# EAGLE design MUX_circuits (EAGLE 7.7.0)
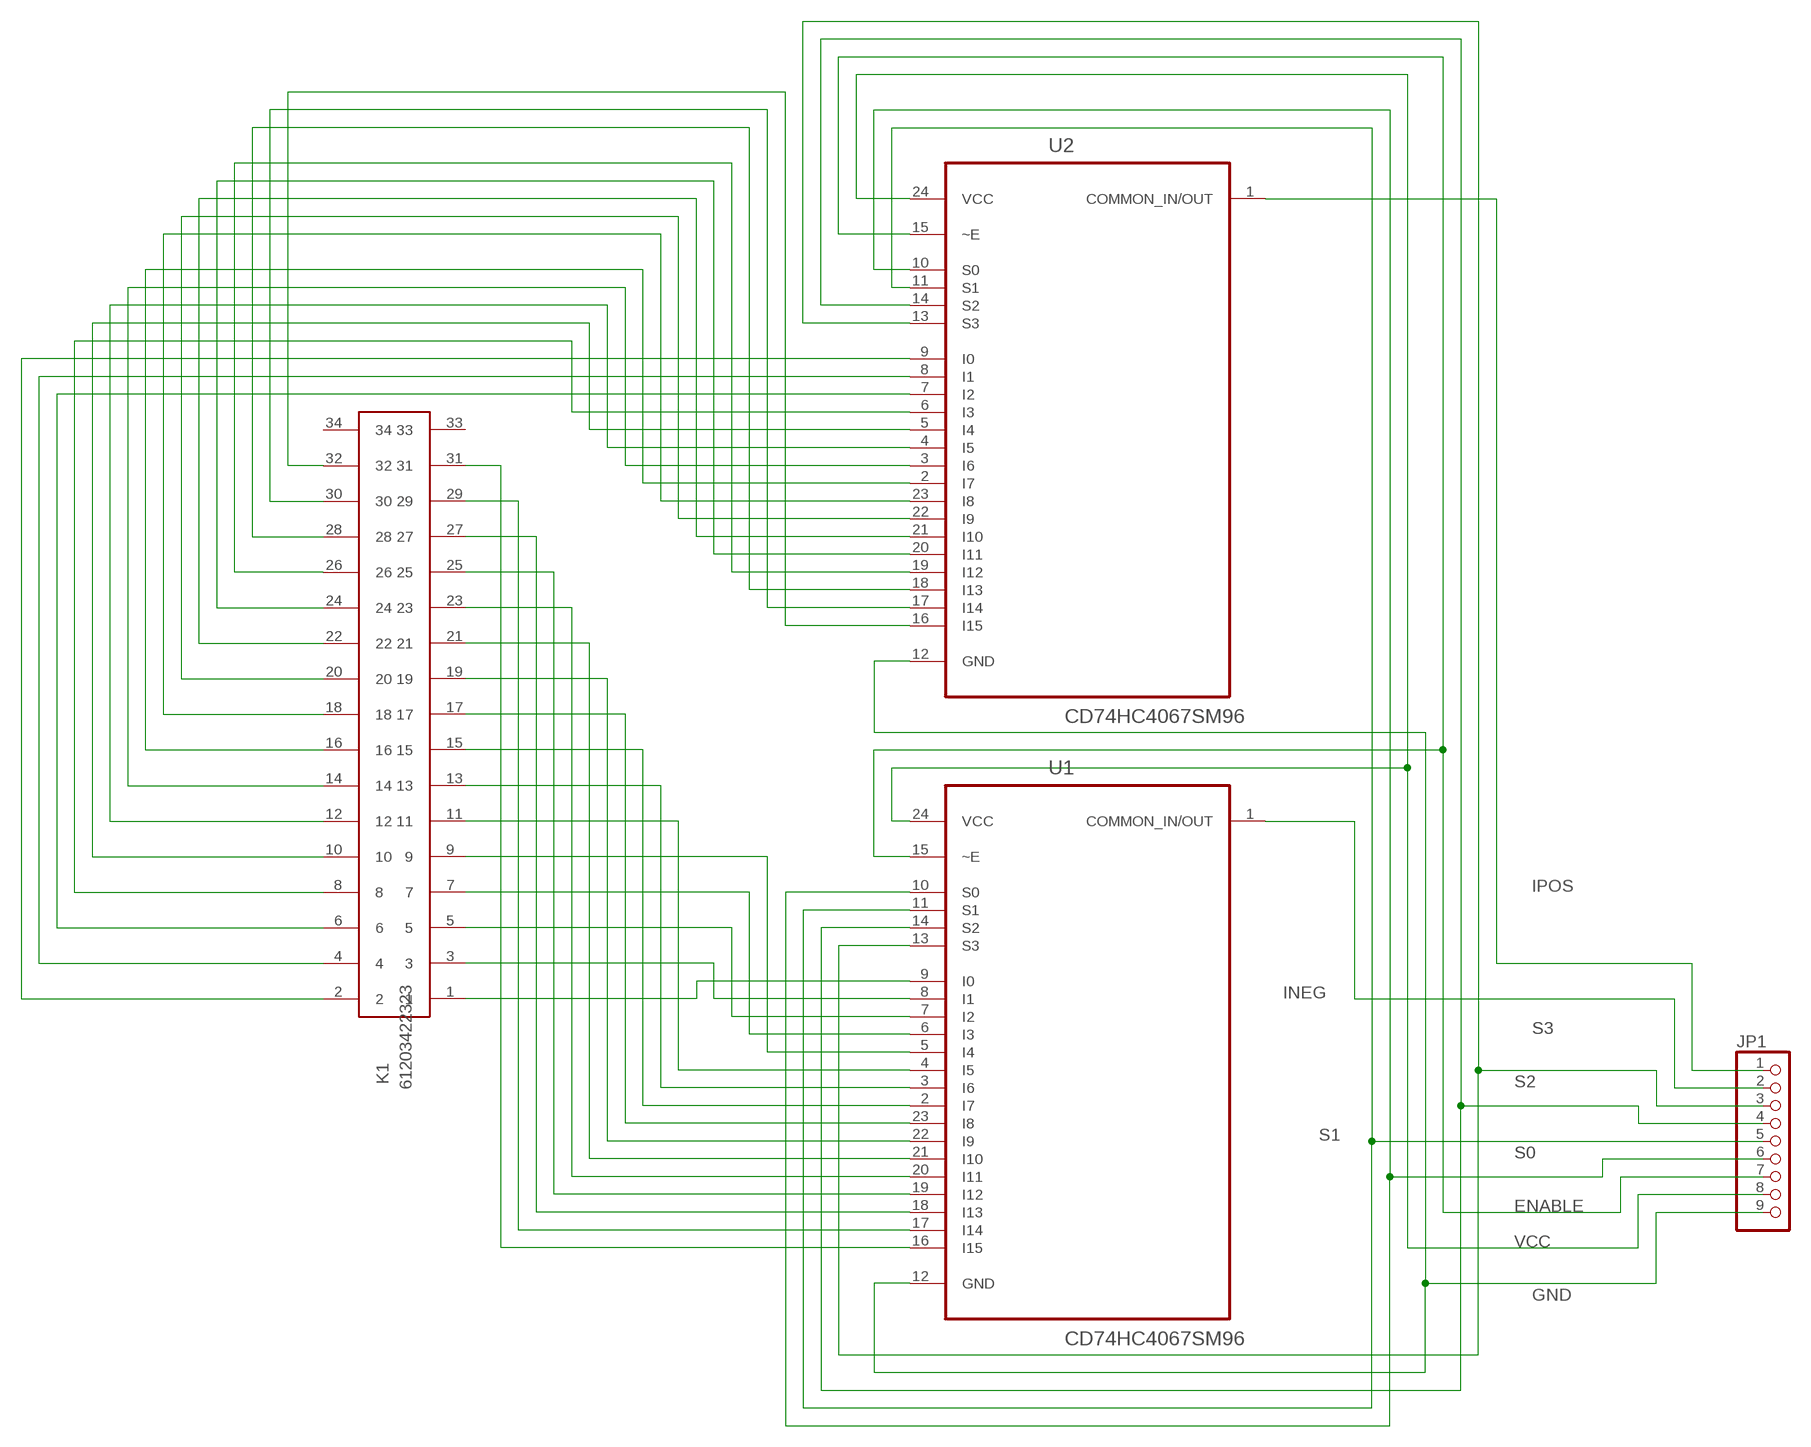
[diagram p0: schematic, sheet 1]

## Parts
JP1  PINHD-1X9  [1X09]
K1  61203422323  [61203422323]
U1  CD74HC4067SM96  [SOP65P780X200-24N]
U2  CD74HC4067SM96  [SOP65P780X200-24N]

## Nets
ENABLE: JP1.7 U1.15(~E) U2.15(~E)
GND: JP1.9 U1.12(GND) U2.12(GND)
INEG: JP1.2 U1.1(COMMON_IN/OUT)
IPOS: JP1.1 U2.1(COMMON_IN/OUT)
N$1: K1.1 U1.9(I0)
N$2: K1.2 U2.9(I0)
N$3: K1.3 U1.8(I1)
N$4: K1.5 U1.7(I2)
N$5: K1.7 U1.6(I3)
N$6: K1.9 U1.5(I4)
N$7: K1.11 U1.4(I5)
N$8: K1.13 U1.3(I6)
N$9: K1.15 U1.2(I7)
N$10: K1.17 U1.23(I8)
N$11: K1.19 U1.22(I9)
N$12: K1.21 U1.21(I10)
N$13: K1.23 U1.20(I11)
N$14: K1.25 U1.19(I12)
N$15: K1.27 U1.18(I13)
N$16: K1.29 U1.17(I14)
N$17: K1.31 U1.16(I15)
N$18: K1.4 U2.8(I1)
N$19: K1.6 U2.7(I2)
N$20: K1.8 U2.6(I3)
N$21: K1.10 U2.5(I4)
N$22: K1.12 U2.4(I5)
N$23: K1.14 U2.3(I6)
N$24: K1.16 U2.2(I7)
N$25: K1.18 U2.23(I8)
N$26: K1.20 U2.22(I9)
N$27: K1.22 U2.21(I10)
N$28: K1.24 U2.20(I11)
N$29: K1.26 U2.19(I12)
N$30: K1.28 U2.18(I13)
N$31: K1.30 U2.17(I14)
N$32: K1.32 U2.16(I15)
S0: JP1.6 U1.10(S0) U2.10(S0)
S1: JP1.5 U1.11(S1) U2.11(S1)
S2: JP1.4 U1.14(S2) U2.14(S2)
S3: JP1.3 U1.13(S3) U2.13(S3)
VCC: JP1.8 U1.24(VCC) U2.24(VCC)
Unconnected: K1.33 K1.34

## Library data of the parts
JP1 = pinhead:PINHD-1X9: PIN HEADER
K1 = Wire_to_Board_Connectors_rev15d:61203422323: WR-BHD 2.54mm Board to Cable Transition Connector, 34 Pins=>Code : Con_WTB_IDC_61203422323 <http://katalog.we-online.de/media/thumbs2/eican/thb_Con_WTB_IDC_6120xx22323_pf2.jpg> Details see: http://katalog.we-online.de/en/em/612_0xx_223_23 Created 2014-06-05, Karrer Zheng 2014 (C) Würth Elektronik
U1 U2 = Texas Instruments_By_element14_Batch_1:CD74HC4067SM96: 16-Channel Analog Multiplexer/Demultiplexer; MPN: CD74HC4067SM96; OC_FARNELL: 1601157; OC_NEWARK: 13N4201; PACKAGE: SOP-24; SUPPLIER: TEXAS INSTRUMENTS

## Board
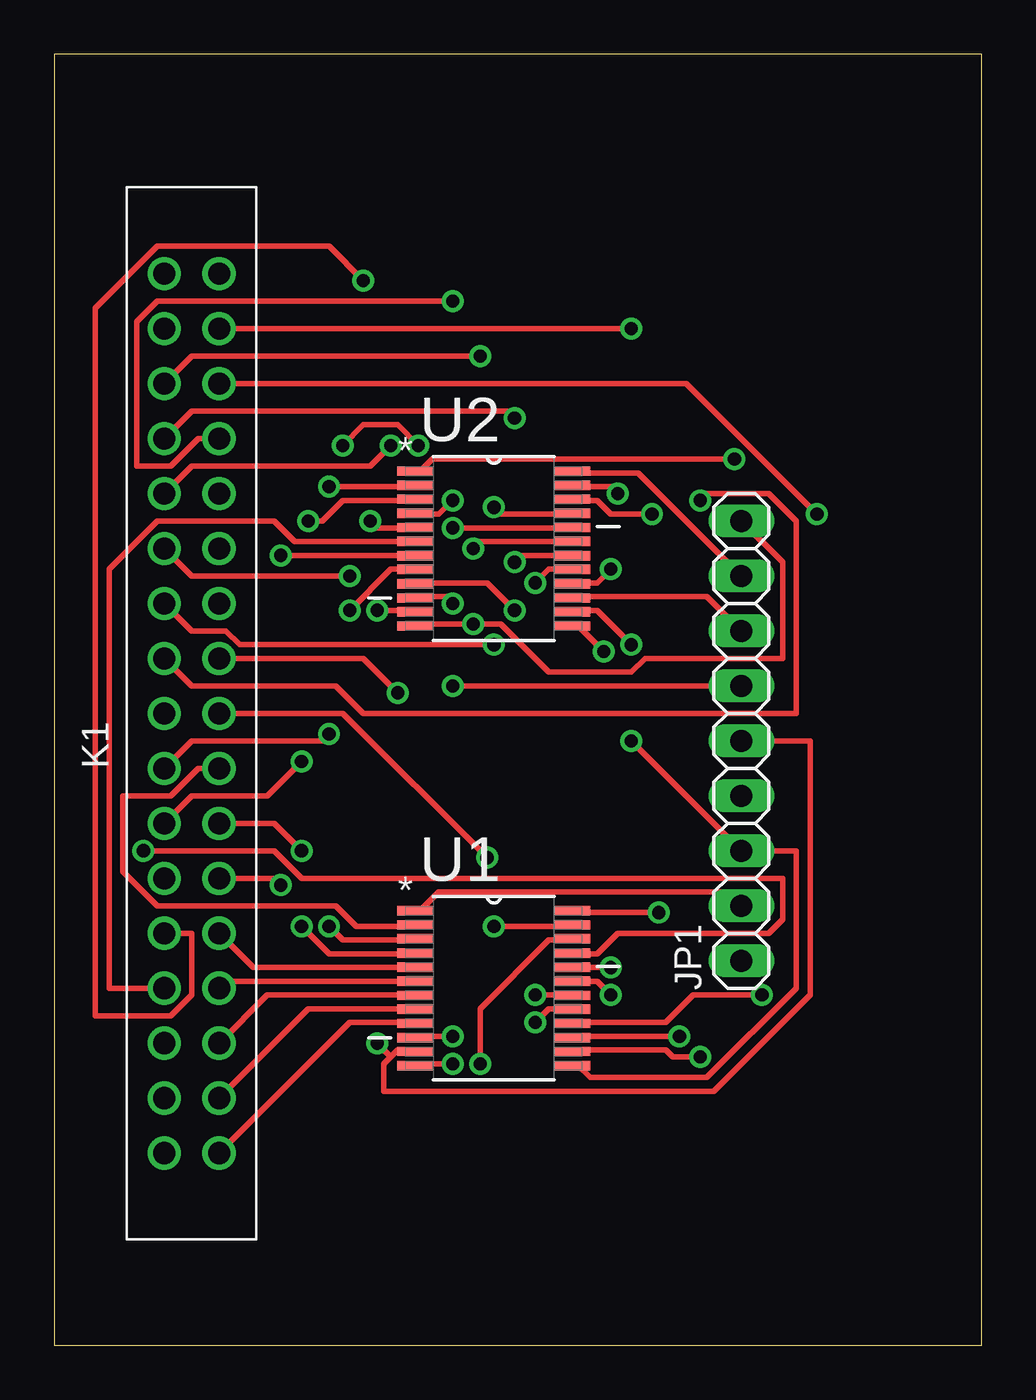
[diagram p1: board, top side]
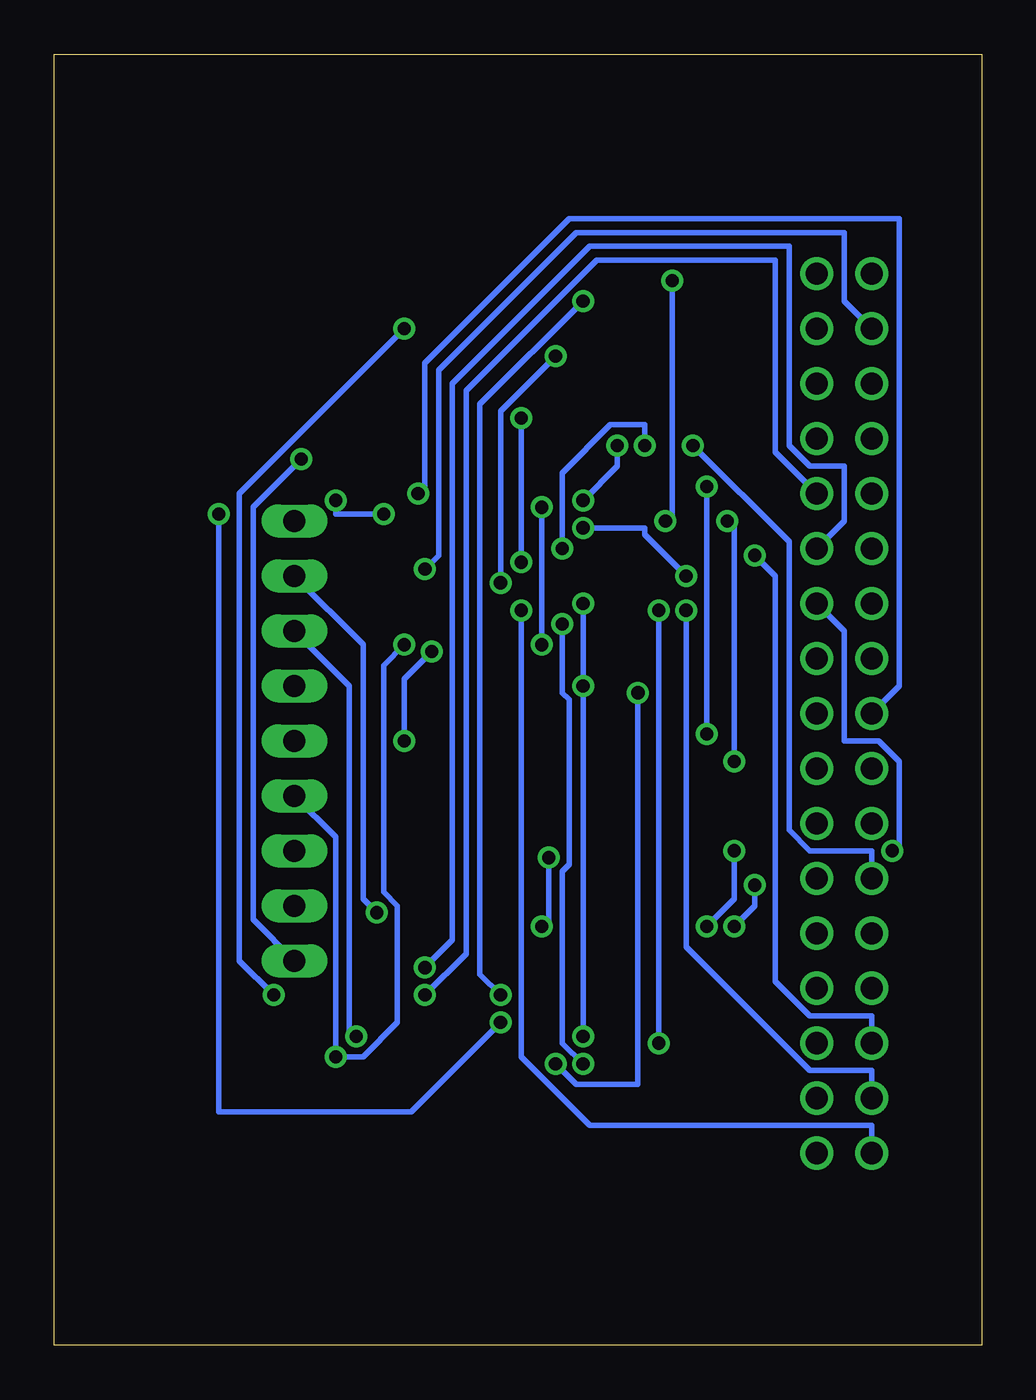
[diagram p2: board, bottom side, seen from below]

Size 42.85 x 59.68 mm. Coordinates in mm from the lower left corner, seen from the top.
Outline: 0,0 42.85,0 42.85,59.68 0,59.68 0,0
Copper layers (1*16): Top 0.035mm / dielectric 1.5mm / Bottom 0.035mm
Design rules "default": minimum track width 10mil, minimum drill 24mil, track to track 8mil, track to pad 8mil, pad to pad 8mil, via to via 8mil, smd to smd 8mil, copper to edge 40mil, drill to drill 8mil, minimum pad ring 10mil, minimum via ring 8mil, stop-mask expansion 4mil, vias tented up to drill 0mil, thermal gap 10mil

### Footprints (pad centres in the part's own frame; a part is rotated, then mirrored left to right if it is on the bottom)
1X09 = drill 1.016 long: 1 -10.16,0; 2 -7.62,0; 3 -5.08,0; 4 -2.54,0; 5 0,0; 6 2.54,0; 7 5.08,0; 8 7.62,0; 9 10.16,0
61203422323 = drill 1.02: 1 -2.54,-1.27; 2 -2.54,1.27; 3 0,-1.27; 4 0,1.27; 5 2.54,-1.27; 6 2.54,1.27; 7 5.08,-1.27; 8 5.08,1.27; 9 7.62,-1.27; 10 7.62,1.27; 11 10.16,-1.27; 12 10.16,1.27; 13 12.7,-1.27; 14 12.7,1.27; 15 15.24,-1.27; 16 15.24,1.27; 17 17.78,-1.27; 18 17.78,1.27; 19 20.32,-1.27; 20 20.32,1.27; 21 22.86,-1.27; 22 22.86,1.27; 23 25.4,-1.27; 24 25.4,1.27; 25 27.94,-1.27; 26 27.94,1.27; 27 30.48,-1.27; 28 30.48,1.27; 29 33.02,-1.27; 30 33.02,1.27; 31 35.56,-1.27; 32 35.56,1.27; 33 38.1,-1.27; 34 38.1,1.27
SOP65P780X200-24N = smd 1.651 x 0.432: 1 -3.632,3.581; 2 -3.632,2.921; 3 -3.632,2.286; 4 -3.632,1.626; 5 -3.632,0.965; 6 -3.632,0.33; 7 -3.632,-0.33; 8 -3.632,-0.965; 9 -3.632,-1.626; 10 -3.632,-2.286; 11 -3.632,-2.921; 12 -3.632,-3.581; 13 3.632,-3.581; 14 3.632,-2.921; 15 3.632,-2.286; 16 3.632,-1.626; 17 3.632,-0.965; 18 3.632,-0.33; 19 3.632,0.33; 20 3.632,0.965; 21 3.632,1.626; 22 3.632,2.286; 23 3.632,2.921; 24 3.632,3.581

### Placement (x,y rotation side)
JP1  31.75,27.94 90 top
K1  6.35,11.43 90 top
U1  20.32,16.51 0 top
U2  20.32,36.83 0 top

### Tracks (layer width: path | path; a pad name or v marks a point on that pad's centre or on a via)
ENABLE  (via drill 0.61)
  Top 0.254: v28.89,14.29 24.13,14.29 U1.15 | JP1.7 30.16,34.61 24.13,34.61 U2.15
  Bottom 0.254: v28.89,14.29 29.21,14.61 29.21,30.48 JP1.7
GND  (via drill 0.61)
  Top 0.254: v18.41,13.02 16.83,13.02 U1.12 | U2.12 16.83,33.34 v19.37,33.34 20.64,33.34 22.86,31.11 26.67,31.11 27.3,31.75 33.66,31.75 33.66,36.2 JP1.9
  Bottom 0.254: v18.41,13.02 19.37,13.97 19.37,21.91 19.05,22.23 19.05,29.84 19.37,30.16 v19.37,33.34
INEG
  Top 0.254: JP1.2 31.11,20.95 17.78,20.95 16.83,20 U1.1
IPOS  (via drill 0.61)
  Top 0.254: v31.43,40.96 17.46,40.96 16.83,40.32 U2.1
  Bottom 0.254: v31.43,40.96 33.66,38.73 33.66,19.68 JP1.1
N$1
  Top 0.254: K1.1 13.65,14.92 16.51,14.92 U1.9
N$2  (via drill 0.61)
  Top 0.254: v21.27,33.97 20,35.24 16.83,35.24 U2.9
  Bottom 0.254: v21.27,33.97 21.27,13.34 18.1,10.16 5.08,10.16 K1.2
N$3
  Top 0.254: K1.3 11.75,15.56 16.51,15.56 U1.8
N$4
  Top 0.254: K1.5 9.84,16.19 16.51,16.19 U1.7
N$5
  Top 0.254: K1.7 7.94,16.83 16.51,16.83 U1.6
N$6
  Top 0.254: K1.9 9.21,17.46 16.51,17.46 U1.5
N$7  (via drill 0.61)
  Top 0.254: v11.43,19.37 12.7,18.1 16.51,18.1 U1.4 | v10.48,21.27 10.16,21.59 K1.11
  Bottom 0.254: v11.43,19.37 10.48,20.32 v10.48,21.27
N$8  (via drill 0.61)
  Top 0.254: v12.7,19.37 13.34,18.73 16.51,18.73 U1.3 | v11.43,22.86 10.16,24.13 K1.13
  Bottom 0.254: v12.7,19.37 11.43,20.64 v11.43,22.86
N$9
  Top 0.254: K1.15 6.67,26.67 5.4,25.4 3.17,25.4 3.17,21.91 4.76,20.32 13.02,20.32 13.97,19.37 16.51,19.37 U1.2
N$10  (via drill 0.61)
  Top 0.254: v20.32,19.37 23.81,19.37 U1.23 | v20,22.54 13.34,29.21 K1.17
  Bottom 0.254: v20.32,19.37 20,19.68 v20,22.54
N$11  (via drill 0.61)
  Top 0.254: v19.68,13.02 19.68,15.56 22.86,18.73 23.81,18.73 U1.22 | v15.88,30.16 14.29,31.75 K1.19
  Bottom 0.254: v19.68,13.02 18.73,12.06 15.88,12.06 v15.88,30.16
N$12  (via drill 0.61)
  Top 0.254: v4.13,22.86 10.16,22.86 11.43,21.59 33.66,21.59 33.66,19.68 33.02,19.05 26.04,19.05 25.08,18.1 24.13,18.1 U1.21
  Bottom 0.254: v4.13,22.86 3.81,23.18 3.81,26.99 4.76,27.94 6.35,27.94 6.35,33.02 K1.21
N$13  (via drill 0.61)
  Top 0.254: v25.72,17.46 24.13,17.46 U1.20
  Bottom 0.254: v25.72,17.46 24.45,18.73 24.45,44.45 18.1,50.8 8.89,50.8 8.89,41.59 7.94,40.64 6.35,40.64 6.35,38.1 K1.23
N$14  (via drill 0.61)
  Top 0.254: v25.72,16.19 25.08,16.83 24.13,16.83 U1.19
  Bottom 0.254: v25.72,16.19 23.81,18.1 23.81,44.13 17.78,50.16 9.53,50.16 9.53,41.27 K1.25
N$15  (via drill 0.61)
  Top 0.254: v22.23,16.19 23.81,16.19 U1.18 | v18.41,48.26 4.76,48.26 3.81,47.31 3.81,40.64 5.4,40.64 6.67,41.91 K1.27
  Bottom 0.254: v22.23,16.19 23.18,17.14 23.18,43.5 v18.41,48.26
N$16  (via drill 0.61)
  Top 0.254: v22.23,14.92 22.86,15.56 23.81,15.56 U1.17 | v35.24,38.42 29.21,44.45 K1.29
  Bottom 0.254: v22.23,14.92 26.35,10.79 35.24,10.79 v35.24,38.42
N$17  (via drill 0.61)
  Top 0.254: v32.7,16.19 29.53,16.19 28.26,14.92 24.13,14.92 U1.16 | K1.31 v26.67,46.99
  Bottom 0.254: v32.7,16.19 34.29,17.78 34.29,39.37 v26.67,46.99
N$18  (via drill 0.61)
  Top 0.254: v13.65,33.97 15.56,35.88 16.51,35.88 U2.8
  Bottom 0.254: v13.65,33.97 13.65,18.41 7.94,12.7 5.08,12.7 K1.4
N$19  (via drill 0.61)
  Top 0.254: v10.48,36.51 16.51,36.51 U2.7
  Bottom 0.254: v10.48,36.51 9.53,35.56 9.53,16.83 7.94,15.24 5.08,15.24 K1.6
N$20
  Top 0.254: K1.8 2.54,16.51 2.54,35.88 4.76,38.1 10.16,38.1 11.11,37.15 16.51,37.15 U2.6
N$21  (via drill 0.61)
  Top 0.254: v14.61,38.1 14.92,37.78 16.51,37.78 U2.5 | v14.29,49.21 12.7,50.8 4.76,50.8 1.91,47.94 1.91,15.24 5.4,15.24 6.35,16.19 6.35,19.05 K1.10
  Bottom 0.254: v14.61,38.1 14.29,38.42 v14.29,49.21
N$22  (via drill 0.61)
  Top 0.254: v18.41,39.05 17.78,38.42 16.83,38.42 U2.4 | v16.83,41.59 15.88,42.55 14.29,42.55 v13.34,41.59
  Bottom 0.254: v18.41,39.05 16.83,40.64 v16.83,41.59 | v13.34,41.59 8.89,37.15 8.89,23.81 7.94,22.86 5.08,22.86 K1.12
N$23  (via drill 0.61)
  Top 0.254: v11.75,38.1 12.38,38.1 13.34,39.05 16.51,39.05 U2.3 | v11.43,26.99 9.84,25.4 6.35,25.4 K1.14
  Bottom 0.254: v11.75,38.1 11.43,37.78 v11.43,26.99
N$24  (via drill 0.61)
  Top 0.254: v12.7,39.69 16.51,39.69 U2.2 | v12.7,28.26 12.38,27.94 6.35,27.94 K1.16
  Bottom 0.254: v12.7,28.26 v12.7,39.69
N$25  (via drill 0.61)
  Top 0.254: v26.04,39.37 25.72,39.69 24.13,39.69 U2.23
  Bottom 0.254: v26.04,39.37 25.72,39.69 25.72,45.4 19.05,52.07 3.81,52.07 3.81,30.48 K1.18
N$26  (via drill 0.61)
  Top 0.254: v27.62,38.42 25.72,38.42 25.08,39.05 24.13,39.05 U2.22 | v29.84,39.05 30.16,39.37 33.02,39.37 34.29,38.1 34.29,29.21 14.29,29.21 13.02,30.48 6.35,30.48 K1.20
  Bottom 0.254: v27.62,38.42 29.84,38.42 v29.84,39.05
N$27  (via drill 0.61)
  Top 0.254: v20.32,38.73 20.64,38.42 23.81,38.42 U2.21 | v20.32,32.38 8.57,32.38 7.94,33.02 6.35,33.02 K1.22
  Bottom 0.254: v20.32,32.38 v20.32,38.73
N$28  (via drill 0.61)
  Top 0.254: v18.41,37.78 23.81,37.78 U2.20 | v13.65,35.56 6.35,35.56 K1.24
  Bottom 0.254: v18.41,37.78 15.56,37.78 15.56,37.47 v13.65,35.56
N$29  (via drill 0.61)
  Top 0.254: v19.37,36.83 19.68,37.15 23.81,37.15 U2.19 | v15.56,41.59 14.61,40.64 6.35,40.64 K1.26
  Bottom 0.254: v19.37,36.83 19.37,40.32 17.14,42.55 15.56,42.55 v15.56,41.59
N$30  (via drill 0.61)
  Top 0.254: v21.27,36.2 21.59,36.51 23.81,36.51 U2.18 | v21.27,42.86 20.95,43.18 6.35,43.18 K1.28
  Bottom 0.254: v21.27,42.86 v21.27,36.2
N$31  (via drill 0.61)
  Top 0.254: v22.23,35.24 22.86,35.88 23.81,35.88 U2.17 | v19.68,45.72 6.35,45.72 K1.30
  Bottom 0.254: v22.23,35.24 22.23,43.18 v19.68,45.72
N$32  (via drill 0.61)
  Top 0.254: v25.72,35.88 25.08,35.24 24.13,35.24 U2.16
  Bottom 0.254: v25.72,35.88 25.08,36.51 25.08,45.09 18.73,51.44 6.35,51.44 6.35,48.26 K1.32
S0  (via drill 0.61)
  Top 0.254: v18.41,14.29 16.83,14.29 U1.10 | v18.41,34.29 18.1,34.61 16.83,34.61 U2.10 | v18.41,30.48 JP1.6
  Bottom 0.254: v18.41,34.29 v18.41,30.48 v18.41,14.29
S1  (via drill 0.61)
  Top 0.254: 15.56,13.34 15.24,13.02 15.24,11.75 30.48,11.75 34.92,16.19 34.92,27.94 JP1.5 | 15.56,13.34 15.88,13.65 16.51,13.65 U1.11 | v14.92,33.97 16.51,33.97 U2.11 | 15.56,13.34 v14.92,13.97
  Bottom 0.254: v14.92,13.97 v14.92,33.97
S2  (via drill 0.61)
  Top 0.254: v29.84,13.34 28.57,13.34 28.26,13.65 24.13,13.65 U1.14 | v26.67,32.38 25.08,33.97 24.13,33.97 U2.14
  Bottom 0.254: JP1.4 29.84,23.5 v29.84,13.34 28.57,13.34 26.99,14.92 26.99,20.32 27.62,20.95 27.62,31.43 v26.67,32.38
S3  (via drill 0.61)
  Top 0.254: U1.13 24.13,13.02 24.77,12.38 30.16,12.38 34.29,16.51 34.29,22.86 JP1.3 v26.67,27.94 | v25.4,32.07 24.13,33.34 U2.13
  Bottom 0.254: v25.4,32.07 26.67,30.8 v26.67,27.94
VCC  (via drill 0.61)
  Top 0.254: v27.94,20 24.13,20 U1.24 | JP1.8 26.99,40.32 24.13,40.32 U2.24
  Bottom 0.254: v27.94,20 28.57,20.64 28.57,32.38 JP1.8